# EAGLE design UB8830_Ersatz_005 EAGLE 630 (EAGLE 6.3)
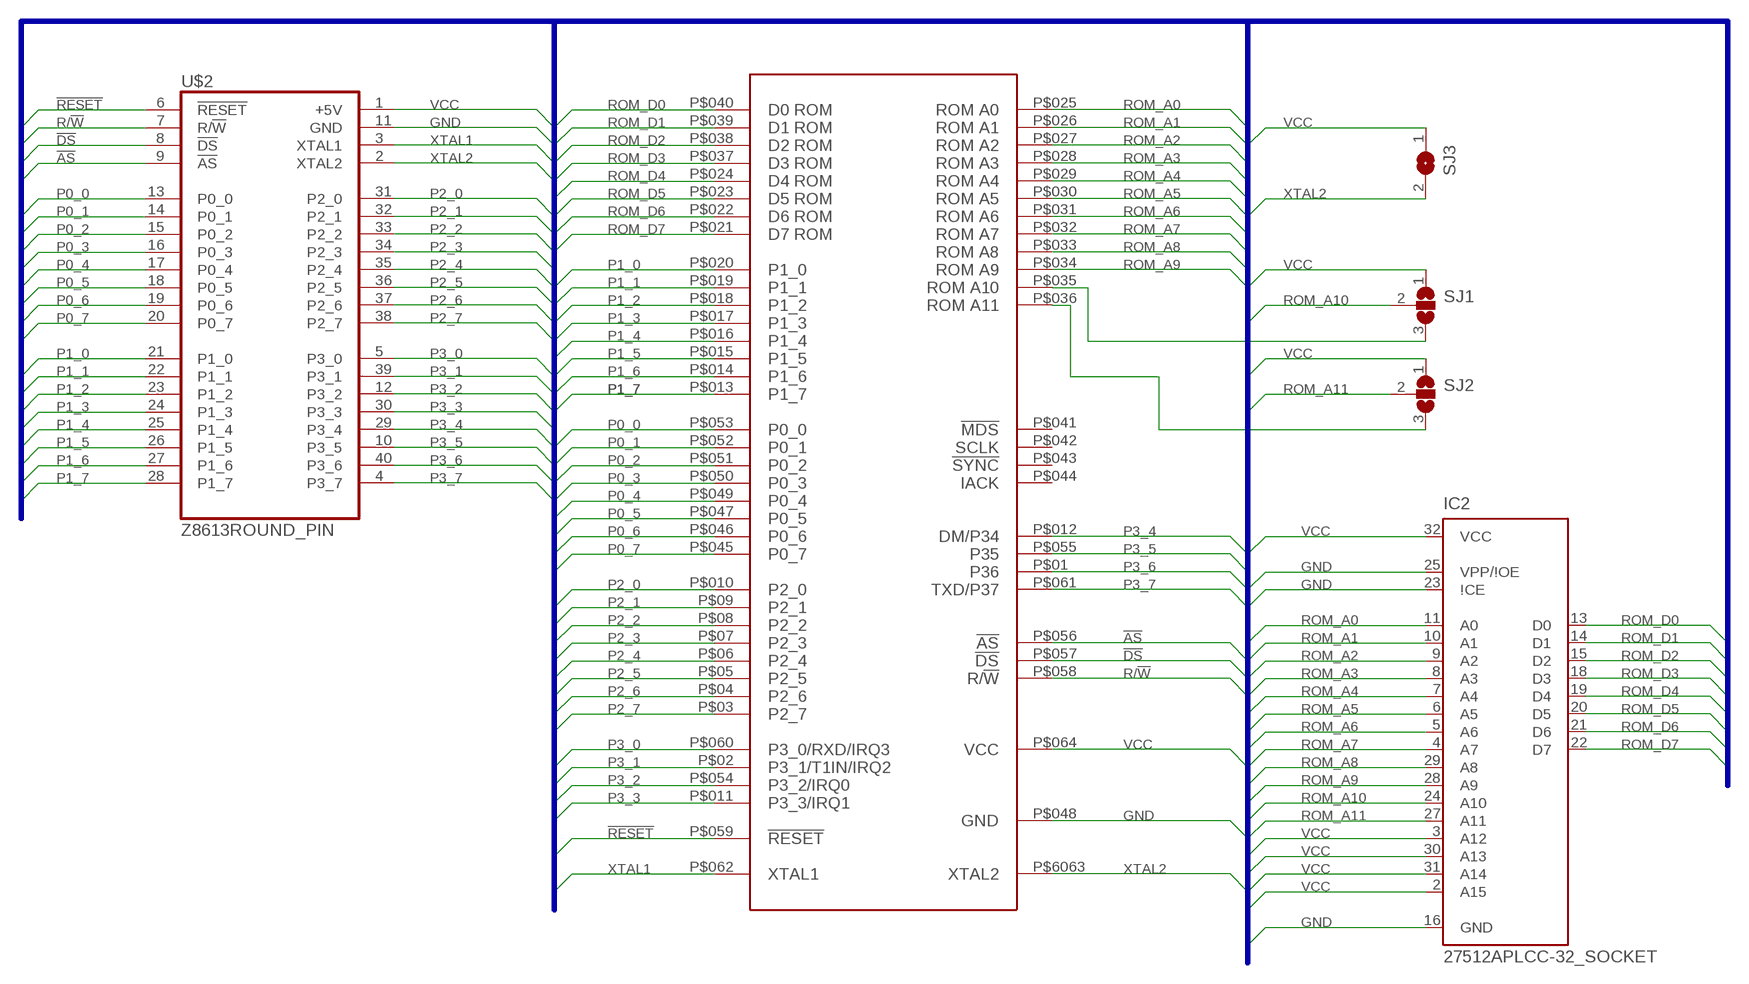
[diagram p0: schematic, sheet 1]

## Parts
IC2  27512APLCC-32_SOCKET  [PLCC-32_SOCKET]
SJ1  SJ2WSJ_2B  [SJ_2B]
SJ2  SJ2WSJ_2B  [SJ_2B]
SJ3  SJ  [SJ]
U$1  UB8821  [QUIT64]
U$2  Z8613ROUND_PIN  [DIL40_ROUND]

## Nets
!AS: U$1.P$056 U$2.9(!AS)
!DS: U$1.P$057 U$2.8(!DS)
!RESET: U$1.P$059 U$2.6(!RESET)
GND: IC2.16(GND) IC2.23(\!CE) IC2.25(VPP/\!OE) U$1.P$048 U$2.11(GND)
N$1: SJ1.3 U$1.P$035
N$2: SJ2.3 U$1.P$036
P0_0: U$1.P$053 U$2.13(P0_0)
P0_1: U$1.P$052 U$2.14(P0_1)
P0_2: U$1.P$051 U$2.15(P0_2)
P0_3: U$1.P$050 U$2.16(P0_3)
P0_4: U$1.P$049 U$2.17(P0_4)
P0_5: U$1.P$047 U$2.18(P0_5)
P0_6: U$1.P$046 U$2.19(P0_6)
P0_7: U$1.P$045 U$2.20(P0_7)
P1_0: U$1.P$020 U$2.21(P1_0)
P1_1: U$1.P$019 U$2.22(P1_1)
P1_2: U$1.P$018 U$2.23(P1_2)
P1_3: U$1.P$017 U$2.24(P1_3)
P1_4: U$1.P$016 U$2.25(P1_4)
P1_5: U$1.P$015 U$2.26(P1_5)
P1_6: U$1.P$014 U$2.27(P1_6)
P1_7: U$1.P$013 U$2.28(P1_7)
P2_0: U$1.P$010 U$2.31(P2_0)
P2_1: U$1.P$09 U$2.32(P2_1)
P2_2: U$1.P$08 U$2.33(P2_2)
P2_3: U$1.P$07 U$2.34(P2_3)
P2_4: U$1.P$06 U$2.35(P2_4)
P2_5: U$1.P$05 U$2.36(P2_5)
P2_6: U$1.P$04 U$2.37(P2_6)
P2_7: U$1.P$03 U$2.38(P2_7)
P3_0: U$1.P$060 U$2.5(P3_0)
P3_1: U$1.P$02 U$2.39(P3_1)
P3_2: U$1.P$054 U$2.12(P3_2)
P3_3: U$1.P$011 U$2.30(P3_3)
P3_4: U$1.P$012 U$2.29(P3_4)
P3_5: U$1.P$055 U$2.10(P3_5)
P3_6: U$1.P$01 U$2.40(P3_6)
P3_7: U$1.P$061 U$2.4(P3_7)
R/!W: U$1.P$058 U$2.7(R/!W)
ROM_A0: IC2.11(A0) U$1.P$025
ROM_A1: IC2.10(A1) U$1.P$026
ROM_A2: IC2.9(A2) U$1.P$027
ROM_A3: IC2.8(A3) U$1.P$028
ROM_A4: IC2.7(A4) U$1.P$029
ROM_A5: IC2.6(A5) U$1.P$030
ROM_A6: IC2.5(A6) U$1.P$031
ROM_A7: IC2.4(A7) U$1.P$032
ROM_A8: IC2.29(A8) U$1.P$033
ROM_A9: IC2.28(A9) U$1.P$034
ROM_A10: IC2.24(A10) SJ1.2
ROM_A11: IC2.27(A11) SJ2.2
ROM_D0: IC2.13(D0) U$1.P$040
ROM_D1: IC2.14(D1) U$1.P$039
ROM_D2: IC2.15(D2) U$1.P$038
ROM_D3: IC2.18(D3) U$1.P$037
ROM_D4: IC2.19(D4) U$1.P$024
ROM_D5: IC2.20(D5) U$1.P$023
ROM_D6: IC2.21(D6) U$1.P$022
ROM_D7: IC2.22(D7) U$1.P$021
VCC: IC2.2(A15) IC2.3(A12) IC2.30(A13) IC2.31(A14) IC2.32(VCC) SJ1.1 SJ2.1 SJ3.1 U$1.P$064 U$2.1(+5V)
XTAL1: U$1.P$062 U$2.3(XTAL1)
XTAL2: SJ3.2 U$1.P$6063 U$2.2(XTAL2)
Unconnected: U$1.P$041 U$1.P$042 U$1.P$043 U$1.P$044

## Buses
BUS:VCC,GND,XTAL1,XTAL2,!RESET,R/!W,!DS,!AS,P0_[0..7],P1_[0..7],P2_[0..7],P3_[0..7],ROM_A[0..11],ROM_D[0..7]

## Library data of the parts
IC2 = microchip-update-2:27*512A: CMOS EPROM 512 K (64 K x 8)
SJ1 SJ2 = jumper:SJ2W: SMD solder JUMPER
SJ3 = jumper:SJ: SMD solder JUMPER
U$1 = NRF24L01_Radio:UB8821
U$2 = zilog:Z8613

## Board
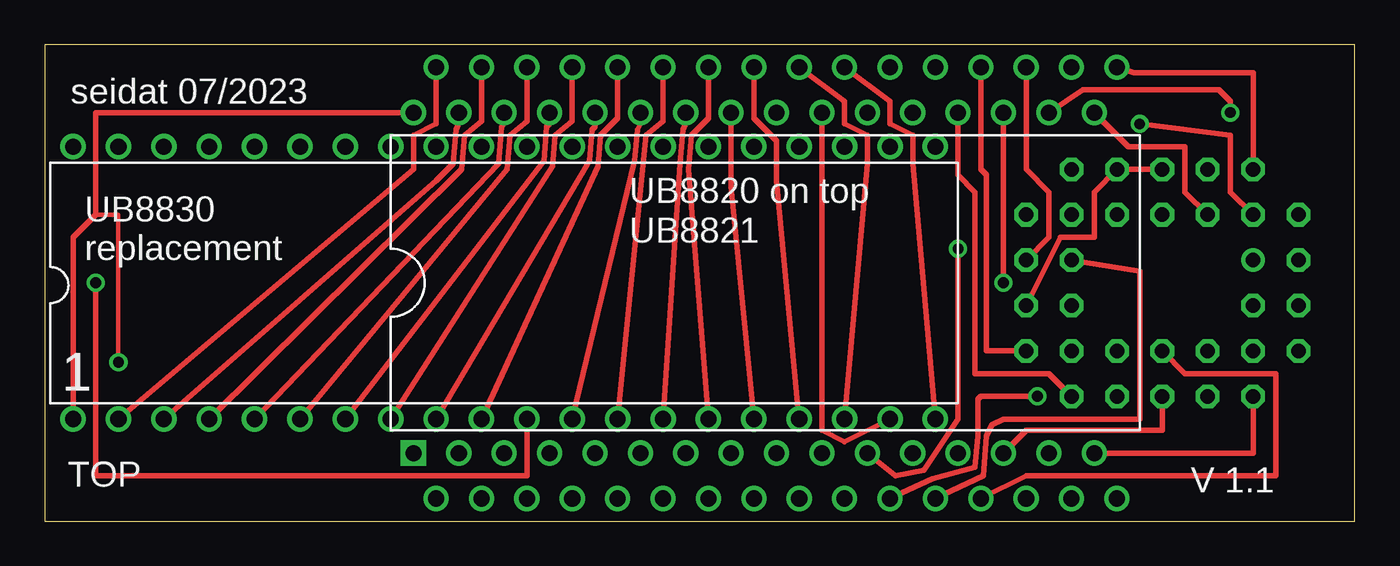
[diagram p1: board, top side]
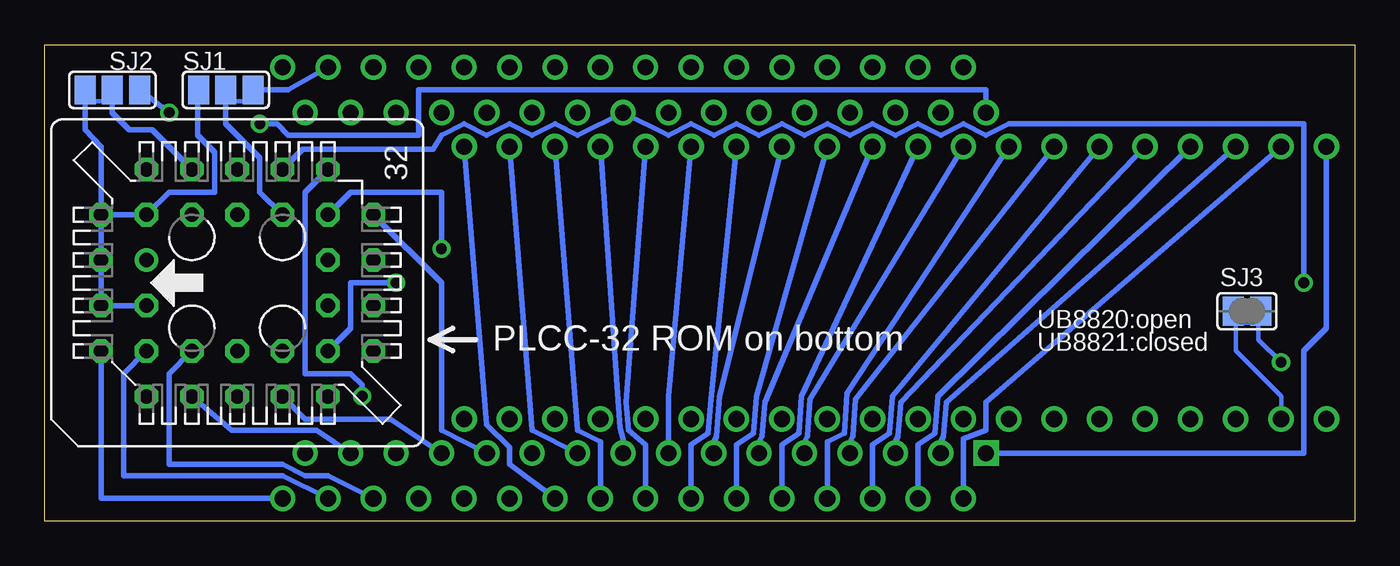
[diagram p2: board, bottom side, seen from below]

Size 73.32 x 26.66 mm. Coordinates in mm from the lower left corner, seen from the top.
Outline: 0,0 73.32,0 73.32,26.66 0,26.66 0,0
Copper layers (1*16): Top 0.035mm / dielectric 1.5mm / Bottom 0.035mm
Design rules "default": minimum track width 10mil, minimum drill 24mil, track to track 8mil, track to pad 8mil, pad to pad 8mil, via to via 8mil, smd to smd 8mil, copper to edge 40mil, drill to drill 8mil, minimum pad ring 10mil, minimum via ring 8mil, stop-mask expansion 4mil, vias tented up to drill 0mil, thermal gap 10mil

### Footprints (pad centres in the part's own frame; a part is rotated, then mirrored left to right if it is on the bottom)
PLCC-32_SOCKET = drill 0.813: 1 1.27,5.08 | drill 0.813 octagon: 2 -1.27,7.62; 3 -1.27,5.08; 4 -3.81,7.62; 5 -6.35,5.08; 6 -3.81,5.08; 7 -6.35,2.54; 8 -3.81,2.54; 9 -6.35,0; 10 -3.81,0; 11 -6.35,-2.54; 12 -3.81,-2.54; 13 -6.35,-5.08; 14 -3.81,-7.62; 15 -3.81,-5.08; 16 -1.27,-7.62; 17 -1.27,-5.08; 18 1.27,-7.62; 19 1.27,-5.08; 20 3.81,-7.62; 21 6.35,-5.08; 22 3.81,-5.08; 23 6.35,-2.54; 24 3.81,-2.54; 25 6.35,0; 26 3.81,0; 27 6.35,2.54; 28 3.81,2.54; 29 6.35,5.08; 30 3.81,7.62; 31 3.81,5.08; 32 1.27,7.62
SJ_2B = smd 1.168 x 1.6: 1 -1.524,0; 2 0,0; 3 1.524,0
SJ = smd 1.168 x 1.6: 1 -0.762,0; 2 0.762,0
QUIT64 = drill 0.9 square: P$01 -19.05,-10.16 | drill 0.9: P$02 -17.78,-12.7; P$03 -16.51,-10.16; P$04 -15.24,-12.7; P$05 -13.97,-10.16; P$06 -12.7,-12.7; P$07 -11.43,-10.16; P$08 -10.16,-12.7; P$09 -8.89,-10.16; P$010 -7.62,-12.7; P$011 -6.35,-10.16; P$012 -5.08,-12.7; P$013 -3.81,-10.16; P$014 -2.54,-12.7; P$015 -1.27,-10.16; P$016 0,-12.7; P$017 1.27,-10.16; P$018 2.54,-12.7; P$019 3.81,-10.16; P$020 5.08,-12.7; P$021 6.35,-10.16; P$022 7.62,-12.7; P$023 8.89,-10.16; P$024 10.16,-12.7; P$025 11.43,-10.16; P$026 12.7,-12.7; P$027 13.97,-10.16; P$028 15.24,-12.7; P$029 16.51,-10.16; P$030 17.78,-12.7; P$031 19.05,-10.16; P$032 20.32,-12.7; P$033 20.32,11.43; P$034 19.05,8.89; P$035 17.78,11.43; P$036 16.51,8.89; P$037 15.24,11.43; P$038 13.97,8.89; P$039 12.7,11.43; P$040 11.43,8.89; P$041 10.16,11.43; P$042 8.89,8.89; P$043 7.62,11.43; P$044 6.35,8.89; P$045 5.08,11.43; P$046 3.81,8.89; P$047 2.54,11.43; P$048 1.27,8.89; P$049 0,11.43; P$050 -1.27,8.89; P$051 -2.54,11.43; P$052 -3.81,8.89; P$053 -5.08,11.43; P$054 -6.35,8.89; P$055 -7.62,11.43; P$056 -8.89,8.89; P$057 -10.16,11.43; P$058 -11.43,8.89; P$059 -12.7,11.43; P$060 -13.97,8.89; P$061 -15.24,11.43; P$062 -16.51,8.89; P$064 -19.05,8.89; P$6063 -17.78,11.43
DIL40_ROUND = drill 0.9 pad 1.422: 1 -24.13,-7.62; 2 -21.59,-7.62; 3 -19.05,-7.62; 4 -16.51,-7.62; 5 -13.97,-7.62; 6 -11.43,-7.62; 7 -8.89,-7.62; 8 -6.35,-7.62; 9 -3.81,-7.62; 10 -1.27,-7.62; 11 1.27,-7.62; 12 3.81,-7.62; 13 6.35,-7.62; 14 8.89,-7.62; 15 11.43,-7.62; 16 13.97,-7.62; 17 16.51,-7.62; 18 19.05,-7.62; 19 21.59,-7.62; 20 24.13,-7.62; 21 24.13,7.62; 22 21.59,7.62; 23 19.05,7.62; 24 16.51,7.62; 25 13.97,7.62; 26 11.43,7.62; 27 8.89,7.62; 28 6.35,7.62; 29 3.81,7.62; 30 1.27,7.62; 31 -1.27,7.62; 32 -3.81,7.62; 33 -6.35,7.62; 34 -8.89,7.62; 35 -11.43,7.62; 36 -13.97,7.62; 37 -16.51,7.62; 38 -19.05,7.62; 39 -21.59,7.62; 40 -24.13,7.62

### Placement (x,y rotation side)
IC2  62.55,13.34 90 bottom
SJ1  63.18,24.13 0 bottom
SJ2  69.53,24.13 0 bottom
SJ3  6.03,11.75 180 bottom
U$1  39.69,13.97 0 top
U$2  25.72,13.34 0 top

### Tracks (layer width: path | path; a pad name or v marks a point on that pad's centre or on a via)
!AS
  Top 0.305: U$1.P$056 30.8,22.07 30.64,21.91 30.48,20.16 U$2.9
!DS
  Top 0.305: U$1.P$057 29.53,22.38 28.57,21.59 28.42,19.84 U$2.8
!RESET
  Top 0.305: U$1.P$059 26.99,22.38 26.04,21.59 25.88,19.68 U$2.6
GND  (via drill 0.61)
  Top 0.305: v2.86,13.34 2.86,2.54 26.99,2.54 U$2.11 | IC2.25 IC2.23 58.74,18.41 58.74,15.88 56.83,15.88 IC2.16
  Bottom 0.305: IC2.23 58.9,20.8 51.59,20.8 51.12,21.59 49.85,22.23 48.58,21.59 47.31,22.23 46.04,21.59 44.77,22.23 43.5,21.59 U$1.P$048 38.42,21.59 37.15,22.23 35.88,21.59 34.61,22.23 33.34,21.59 32.07,22.23 30.8,21.59 29.53,22.23 28.26,21.59 26.99,22.23 25.72,21.59 24.45,22.23 23.18,21.59 21.91,22.23 20.64,21.59 19.37,22.23 2.86,22.23 v2.86,13.34
N$1
  Bottom 0.305: U$1.P$035 59.69,24.13 SJ1.3
N$2  (via drill 0.6)
  Top 0.305: v66.36,22.86 66.36,23.5 65.72,24.13 58.1,24.13 U$1.P$036
  Bottom 0.305: SJ2.3 v66.36,22.86
N$3
  Bottom 0.254: 5.4,11.11 6.67,11.11
P0_0
  Top 0.305: U$1.P$053 34.61,22.38 33.65,21.59 U$2.13
P0_1
  Top 0.305: U$1.P$052 35.88,22.23 35.72,21.91 35.56,20 U$2.14
P0_2
  Top 0.305: U$1.P$051 37.15,22.54 36.2,21.59 36.04,19.68 U$2.15
P0_3
  Top 0.305: U$1.P$050 38.42,18.73 U$2.16
P0_4
  Top 0.305: U$1.P$049 39.69,22.54 40.96,21.27 40.96,19.05 U$2.17
P0_5
  Top 0.305: U$1.P$047 44.77,23.5 44.77,22.23 46.04,21.59 46.04,20 U$2.18
P0_6
  Top 0.305: U$2.19 44.77,4.45 43.5,5.08 U$1.P$046
P0_7
  Top 0.305: U$1.P$045 47.31,23.5 47.31,22.23 48.58,21.59 48.58,20 U$2.20
P1_0
  Bottom 0.305: U$2.21 48.58,5.4 47.31,4.13 47.31,3.17 U$1.P$020
P1_1
  Bottom 0.305: U$2.22 46.04,5.08 U$1.P$019
P1_2
  Bottom 0.305: U$2.23 43.5,5.08 42.23,4.45 U$1.P$018
P1_3
  Bottom 0.305: U$2.24 41.27,7.14 41.12,5.24 40.96,4.6 U$1.P$017
P1_4
  Bottom 0.305: U$2.25 40.8,6.67 40.64,5.08 39.69,4.29 U$1.P$016
P1_5
  Bottom 0.305: U$2.26 38.42,6.99 U$1.P$015
P1_6
  Bottom 0.305: U$2.27 36.04,6.83 36.2,4.92 37.15,4.29 U$1.P$014
P1_7
  Bottom 0.305: U$2.28 35.56,6.99 35.72,4.76 35.88,4.45 U$1.P$013
P2_0
  Bottom 0.305: U$1.P$010 32.07,4.29 31.12,4.92 30.96,6.99 U$2.31
P2_1
  Bottom 0.305: U$1.P$09 30.8,4.45 30.64,4.76 30.48,6.83 U$2.32
P2_2
  Bottom 0.305: U$1.P$08 29.53,4.45 28.57,4.92 28.42,7.14 U$2.33
P2_3
  Bottom 0.305: U$1.P$07 28.26,4.45 28.1,4.76 27.94,6.83 U$2.34
P2_4
  Bottom 0.305: U$1.P$06 26.99,4.29 26.04,4.92 25.88,6.99 U$2.35
P2_5
  Bottom 0.305: U$1.P$05 25.72,4.45 25.56,4.76 25.4,6.67 U$2.36
P2_6
  Bottom 0.305: U$1.P$04 24.45,4.29 23.49,4.92 23.34,6.99 U$2.37
P2_7
  Bottom 0.305: U$1.P$03 23.18,4.45 23.02,4.76 22.86,6.67 U$2.38
P3_0
  Top 0.305: U$2.5 25.4,20 25.56,22.07 25.72,22.23 U$1.P$060
P3_1
  Bottom 0.305: U$1.P$02 21.91,4.6 20.64,5.08 20.64,6.67 U$2.39
P3_2
  Top 0.305: U$1.P$054 33.34,22.23 33.18,21.91 33.02,20.16 U$2.12
P3_3
  Bottom 0.305: U$1.P$011 33.34,4.45 33.18,4.76 33.02,6.67 U$2.30
P3_4
  Bottom 0.305: U$1.P$012 34.61,4.29 33.65,4.92 33.5,6.99 U$2.29
P3_5
  Top 0.305: U$1.P$055 32.07,22.54 31.12,21.59 30.96,19.84 U$2.10
P3_6
  Bottom 0.305: U$1.P$01 2.86,3.81 2.86,9.53 1.59,10.79 U$2.40
P3_7
  Top 0.305: U$1.P$061 24.45,22.38 23.49,21.59 23.34,19.68 U$2.4
R/!W
  Top 0.305: U$1.P$058 28.26,22.23 28.1,22.07 27.94,20.16 U$2.7
ROM_A0
  Bottom 0.305: IC2.11 58.74,5.71 53.97,5.71 U$1.P$025
ROM_A1
  Top 0.305: U$1.P$026 54.93,2.54 68.9,2.54 68.9,8.26 63.82,8.26 IC2.10
ROM_A2
  Top 0.305: IC2.9 62.55,5.08 54.93,5.08 U$1.P$027
ROM_A3
  Bottom 0.305: U$1.P$028 57.47,2.54 58.74,2.54 60.01,3.17 66.36,3.17 66.36,8.26 IC2.8
ROM_A4
  Bottom 0.305: IC2.7 62.86,5.08 58.1,5.08 U$1.P$029
ROM_A5
  Bottom 0.305: U$1.P$030 60.01,2.54 68.9,2.54 68.9,8.26 IC2.6
ROM_A6
  Top 0.305: U$1.P$031 67.63,3.81 IC2.5
ROM_A7
  Bottom 0.305: U$1.P$032 70.17,1.27 IC2.4
ROM_A8
  Top 0.305: U$1.P$033 60.96,25.08 67.63,25.08 IC2.29
ROM_A9
  Top 0.305: U$1.P$034 60.64,20.95 63.82,20.95 63.82,18.41 IC2.28
ROM_A10
  Bottom 0.254: 62.86,23.5 61.91,23.5
  Bottom 0.305: IC2.24 61.28,18.41 61.28,20.32 63.18,22.23 SJ1.2 62.86,23.5
ROM_A11
  Bottom 0.254: 69.85,23.5 70.8,23.5
  Bottom 0.305: IC2.27 67.31,21.91 68.58,21.91 69.53,22.86 SJ2.2 69.85,23.5
ROM_D0
  Top 0.305: U$1.P$040 51.12,19.37 52.07,18.41 52.07,8.26 56.2,8.26 IC2.13
ROM_D1
  Top 0.305: U$1.P$039 52.39,19.68 52.71,19.37 52.71,9.53 IC2.14
ROM_D2  (via drill 0.6)
  Top 0.305: U$1.P$038 v53.66,13.34
  Bottom 0.305: v53.66,13.34 56.2,13.34 56.2,10.79 IC2.15
ROM_D3
  Top 0.305: U$1.P$037 54.93,19.68 56.2,18.41 56.2,15.88 IC2.18
ROM_D4
  Top 0.305: U$1.P$024 52.55,2.54 52.71,4.76 53.02,5.4 53.66,5.71 61.28,5.71 61.28,13.97 IC2.19
ROM_D5
  Bottom 0.305: U$1.P$023 51.12,5.08 51.12,13.34 IC2.20
ROM_D6  (via drill 0.6)
  Top 0.305: U$1.P$022 49.69,2.38 52.07,3.02 52.23,4.76 52.23,6.83 52.39,6.99 v55.56,6.99
  Bottom 0.305: v55.56,6.99 55.56,7.62 56.2,8.26 58.74,8.26 58.74,18.41 IC2.21
ROM_D7  (via drill 0.6)
  Top 0.305: U$1.P$021 47.62,2.54 49.21,2.86 51.12,5.71 v51.12,15.24
  Bottom 0.305: v51.12,15.24 51.12,18.41 56.2,18.41 IC2.22
VCC  (via drill 0.6, 0.61)
  Top 0.254: 2.86,17.14 4.13,17.14 v4.13,8.89
  Top 0.305: U$2.1 1.59,15.88 2.86,17.14 2.86,22.86 U$1.P$064 | v61.28,22.23 66.36,21.59 66.36,18.41 IC2.31
  Bottom 0.254: v4.13,8.89 5.4,10.16 5.4,11.43 SJ3.1
  Bottom 0.305: IC2.30 70.17,20.95 71.06,21.91 SJ2.1 | IC2.30 IC2.32 IC2.2 IC2.3 | IC2.30 IC2.31 66.36,18.41 63.82,18.41 63.82,20.64 64.77,21.59 64.77,24.13 | U$1.P$064 20.64,24.13 52.39,24.13 52.39,21.59 59.69,21.59 60.32,22.23 v61.28,22.23
  Bottom 0.406: SJ1.1 64.77,24.13
XTAL1
  Top 0.305: U$1.P$062 23.18,22.23 23.02,21.91 22.86,20 21.91,19.05 U$2.3
XTAL2
  Top 0.305: U$1.P$6063 21.91,22.23 20.64,21.59 20.64,19.68 U$2.2
  Bottom 0.254: SJ3.2 6.67,11.43 6.67,9.53 4.13,6.99 U$2.2

### Text on the board
tPlace: seidat 07/2023 | UB8820 on top | UB8821 | UB8830 / replacement | TOP | V 1.1
tNames: 1
bNames: UB8820:open | UB8821:closed | PLCC-32 ROM on bottom